# EasyEDA Pro project AT32M412_EVB.eprj, board AT32M412_EVB
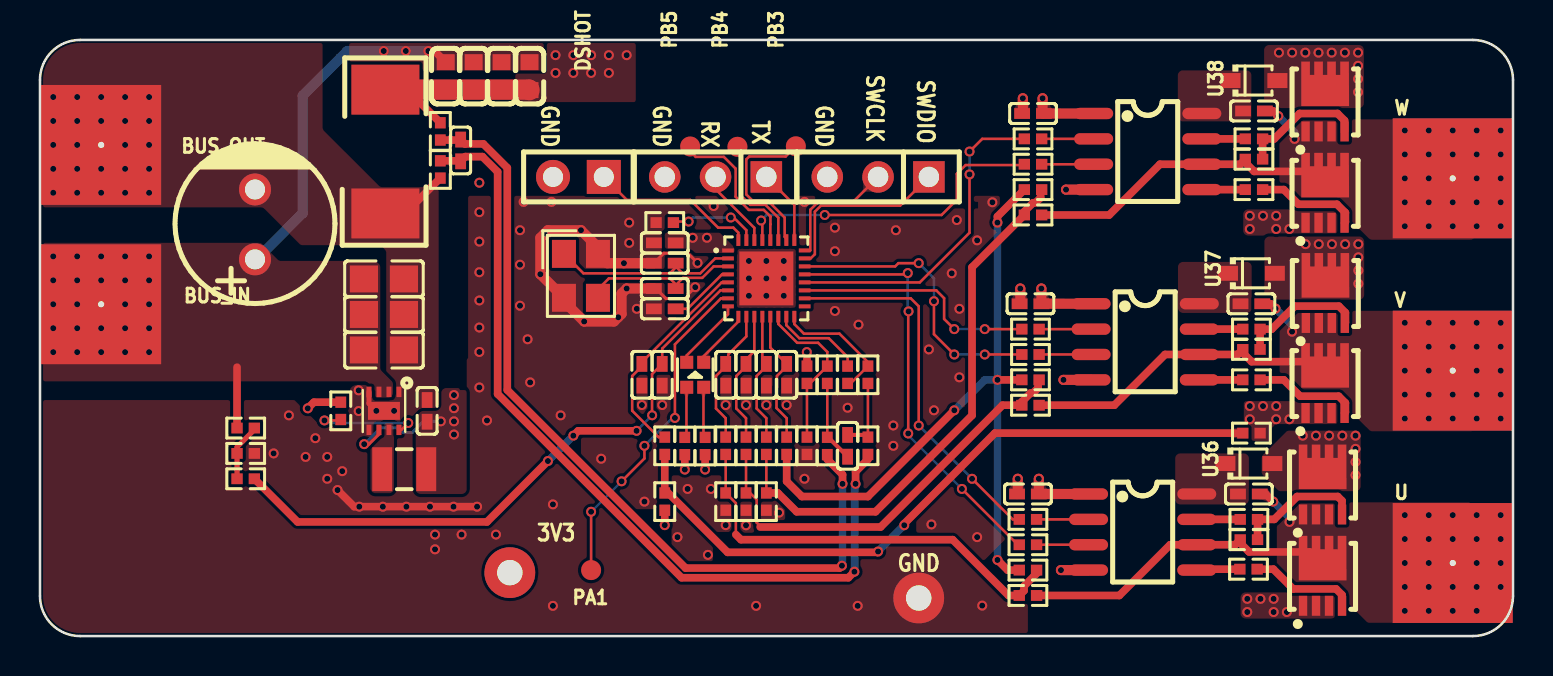
[diagram p4: board, top side]
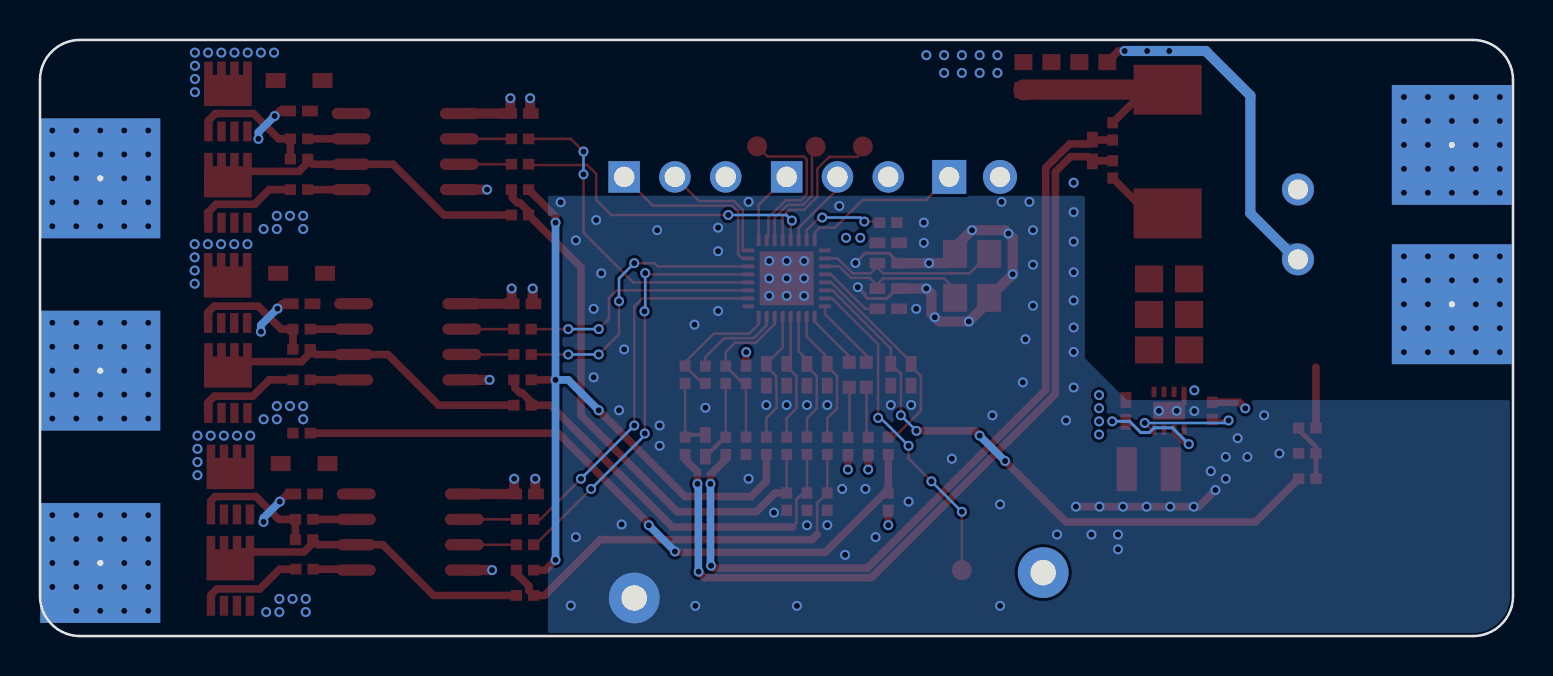
[diagram p5: board, bottom side, seen from below]

Outline 73.66 x 29.84 mm; copper layers: Top Layer, GND02, PWR03, Bottom Layer. Coordinates in mm from the lower left corner of the outline.
Outline path: 0,27.84 0,2 arc(0.59,0.59) 2,0 71.66,0 arc(73.07,0.59) 73.66,2 73.66,27.84 arc(73.07,29.26) 71.66,29.84 2,29.84 arc(0.59,29.26) 0,27.84
Stack: Top Layer 0.035mm 外层铜厚1oz / Dielectric1 0.2104mm 7628 RC49% 8.6mil / GND02 0.0152mm 内层铜厚 / Dielectric2 1.065mm 1.1mm H/HOZ Copper / PWR03 0.0152mm 内层铜厚 / Dielectric3 0.2104mm 7628 RC49% 8.6mil / Bottom Layer 0.035mm 外层铜厚1oz

## Design rules (mm)
template: 自定义配置
spacing copperThickness1oz (default): track to track 0.102, other pairs 0.152 to 0.3
spacing copperThickness2oz: track to track 0.203, other pairs 0.152 to 0.3
spacing edgeClearance: track to track 0.152, other pairs 0 to 0.152
track width copperThickness1oz (default): min 0.127, default 0.127, max 2.54
track width PWR: min 0.152, default 0.381, max 2.54
differential pair 90ohm (default): width min 0.152, default 0.152, max 0.152; gap min 0.178, default 0.178
via viaSize (default): diameter min 0.5, default 0.5, max 10; hole min 0.3, default 0.305, max 6.299
net GND uses PWR
net VCC_3V3 uses PWR
net GNDP uses PWR
net VBUS uses PWR
region e2146 uses edgeClearance
region e2147 uses edgeClearance
region e2148 uses edgeClearance
region e923 uses edgeClearance
region e924 uses edgeClearance

## Placement (name value [footprint] x y rotation side)
ATLINK  PM254V-11-03-H85  [HDR-TH_3P-P2.54-V-F]  41.91 22.99 180 top
BUS_IN  -  [PAD_35A]  1.79 17.12 0 top
BUS_OUT  -  [PAD_35A]  1.79 25.1 0 top
C131  100nF  [C0402]  31.24 19.69 0 top
C205  220uF  [CAP-TH_BD8.0-P3.50-D0.6-FD]  10.75 20.61 90 top
C206  22uF  [C0805]  17.2 16.1 180 top
C207  22uF  [C0805]  17.2 17.88 180 top
C208  10uF  [C0805]  17.2 14.32 180 top
C210  22uF  [C0402]  19.36 11.27 270 top
C211  100nF  [C0402]  31.24 16.38 0 top
C212  12pF  [C0402]  31.24 18.67 180 top
C213  12pF  [C0402]  31.24 17.4 0 top
C214  100nF  [C0402]  49.4 7.11 180 top
C215  100nF  [C0402]  60.45 7.11 180 top
C216  100nF  [C0402]  49.53 16.64 180 top
C217  100nF  [C0402]  60.58 16.64 180 top
C218  100nF  [C0402]  49.66 26.16 180 top
C219  100nF  [C0402]  60.71 26.29 180 top
C220  2.2nF  [C0402]  21.03 24.31 270 top
C221  2.2uF  [C0603]  24.48 28.03 90 top
C222  2.2uF  [C0603]  21.69 28.03 90 top
C223  2.2uF  [C0603]  20.29 28.03 90 top
C224  2.2uF  [C0603]  23.08 28.03 90 top
C225  100nF  [C0402]  31.12 13.08 90 top
C226  100nF  [C0402]  30.1 13.08 90 top
C227  33pF  [C0402]  34.29 13.08 90 top
C228  33pF  [C0402]  35.31 13.08 90 top
C229  33pF  [C0402]  36.32 13.08 90 top
C230  33pF  [C0402]  37.34 13.08 90 top
C231  100pF  [C0402]  40.39 9.53 270 top
D37  1N4148WS  [SOD-323_L1.8-W1.3-LS2.5-RD]  60.45 8.64 0 top
D38  1N4148WS  [SOD-323_L1.8-W1.3-LS2.5-RD]  60.58 18.16 0 top
D39  1N4148WS  [SOD-323_L1.8-W1.3-LS2.5-RD]  60.71 27.81 0 top
DSHOT  2.54-1*2P母  [HDR-TH_2P-P2.54-V-F]  26.92 22.99 180 top
L11  2.2uH  [IND-SMD_L2.5-W2.0_MHCHL2520]  18.22 8.35 0 top
LED1  NCD1615RG1  [LED-SMD_4P-L1.6-W1.5-TL-1]  32.77 13.08 270 top
NOREF  -  [Pad_e740]  23.5 3.17 0 top
NOREF#2  -  [Pad_e738]  43.94 1.91 0 top
PA1  -  [Mark-Point-1mm]  27.56 3.3 0 top
PB3  -  [Mark-Point-1mm]  37.8 24.52 0 top
PB4  -  [Mark-Point-1mm]  34.88 24.5 0 top
PB5  -  [Mark-Point-1mm]  32.51 24.51 0 top
Q1  TMG60N04DF  [POWERDI3333-8_DMN7022LFGQ-7]  64.13 7.11 0 top
Q2  TMG60N04DF  [POWERDI3333-8_DMN7022LFGQ-7]  64.13 2.54 0 top
Q3  TMG60N04DF  [POWERDI3333-8_DMN7022LFGQ-7]  64.28 16.7 0 top
Q4  TMG60N04DF  [POWERDI3333-8_DMN7022LFGQ-7]  64.26 12.19 0 top
Q5  TMG60N04DF  [POWERDI3333-8_DMN7022LFGQ-7]  64.26 26.29 0 top
Q6  TMG60N04DF  [POWERDI3333-8_DMN7022LFGQ-7]  64.26 21.72 0 top
R186  100kΩ  [R0402]  15.04 11.27 270 top
R188  1kΩ  [R0402]  31.24 20.7 180 top
R189  1kΩ  [R0402]  32.24 9.51 90 top
R190  1kΩ  [R0402]  33.26 9.51 90 top
R191  10Ω  [R0402]  60.45 5.84 0 top
R192  10Ω  [R0402]  60.43 3.35 0 top
R193  10Ω  [R0402]  60.58 15.37 0 top
R194  10Ω  [R0402]  60.58 12.83 0 top
R195  10Ω  [R0402]  60.71 24.89 0 top
R196  10Ω  [R0402]  60.71 22.35 0 top
R197  10Ω  [R0402]  49.4 5.84 0 top
R198  10Ω  [R0402]  49.4 4.57 0 top
R199  10Ω  [R0402]  49.53 15.37 0 top
R200  10Ω  [R0402]  49.53 14.1 0 top
R201  10Ω  [R0402]  49.66 24.89 0 top
R202  10Ω  [R0402]  49.66 23.62 0 top
R203  2mΩ  [RES-SMD_L6.4-W3.2-1]  17.27 24.26 270 top
R204  10Ω  [R0402]  20.02 25.27 90 top
R205  10Ω  [R0402]  20.02 23.36 270 top
R206  NCP15XH103F03RC  [R0402]  60.58 10.16 180 top
R207  3kΩ  [R0402]  31.24 6.73 270 top
R208  100Ω  [R0402]  10.29 7.87 0 top
R209  100Ω  [R0402]  31.24 9.53 90 top
R211  51kΩ  [R0402]  49.4 3.3 0 top
R213  3kΩ  [R0402]  34.29 6.73 270 top
R214  43kΩ  [R0402]  49.4 2.03 0 top
R215  51kΩ  [R0402]  49.53 12.83 0 top
R216  43kΩ  [R0402]  49.53 11.56 0 top
R217  3kΩ  [R0402]  35.31 6.73 270 top
R218  51kΩ  [R0402]  49.66 22.35 0 top
R219  43kΩ  [R0402]  49.66 21.08 0 top
R220  3kΩ  [R0402]  36.32 6.73 270 top
R221  1Ω  [R0402]  34.29 9.53 90 top
R222  1Ω  [R0402]  35.31 9.53 90 top
R223  1Ω  [R0402]  36.32 9.53 90 top
R224  1Ω  [R0402]  37.34 9.53 90 top
R225  1.2kΩ  [R0402]  39.37 9.52 90 top
R226  1.2kΩ  [R0402]  41.4 9.53 90 top
R227  1.2kΩ  [R0402]  39.37 13.08 90 top
R228  1.2kΩ  [R0402]  41.4 13.08 90 top
R229  66.5kΩ  [R0402]  40.39 13.08 90 top
R230  47kΩ  [R0402]  10.29 10.41 0 top
R231  10kΩ  [R0402]  10.29 9.14 0 top
R237  133kΩ  [R0402]  38.35 13.08 270 top
R238  133kΩ  [R0402]  38.35 9.53 90 top
R239  10kΩ  [R0402]  60.45 4.83 0 top
R240  10kΩ  [R0402]  60.58 14.35 0 top
R241  10kΩ  [R0402]  60.71 23.88 0 top
U  -  [PAD_35A]  69.38 4.17 0 top
U33  TPS62172DSGR  [WSON-8_L2.0-W2.0-P0.50-TL-EP]  17.2 11.27 270 top
U34  AT32M412KBU7-4  [WQFN-32_L4.0-W4.0-P0.40-TL-EP2.7]  36.32 17.91 0 top
U36  IRS21867STRPBF  [SOIC-8_L5.0-W4.0-P1.27-LS6.0-BL]  55.14 5.21 270 top
U37  IRS21867STRPBF  [SOIC-8_L5.0-W4.0-P1.27-LS6.0-BL]  55.27 14.73 270 top
U38  IRS21867STRPBF  [SOIC-8_L5.0-W4.0-P1.27-LS6.0-BL]  55.39 24.26 270 top
UART  PM254V-11-03-H85  [HDR-TH_3P-P2.54-V-F]  33.78 22.99 180 top
V  -  [PAD_35A]  69.38 13.8 0 top
W  -  [PAD_35A]  69.38 23.42 0 top
X3  24MHz  [CRYSTAL-SMD_4P-L3.2-W2.5-BL]  27.05 18.03 270 top

## Footprints (pads in the part's own frame, mm; a bottom-side part is the same pattern mirrored in y, then rotated)
C0402
  rect 0.79x0.54 smd: 1(-0.545,0) 2(0.545,0)
C0603
  rect 0.8x0.9 smd: 1(-0.7,0) 2(0.7,0)
C0805
  rect 1.41x1.35 smd: 1(-1,0) 2(1,0)
CAP-TH_BD8.0-P3.50-D0.6-FD
  round 1.6 hole 1: 1(-1.75,0) 2(1.75,0)
CRYSTAL-SMD_4P-L3.2-W2.5-BL
  rect 1.4x1.2 smd: 1(-1.1,-0.85) 2(1.1,-0.85) 3(1.1,0.85) 4(-1.1,0.85)
HDR-TH_2P-P2.54-V-F
  rect 1.7x1.7 hole 1: 1(-1.27,0)
  round 1.7 hole 1: 2(1.27,0)
HDR-TH_3P-P2.54-V-F
  rect 1.575x1.575 hole 1.02: 1(-2.54,0)
  round 1.575 hole 1.02: 2(0,0) 3(2.54,0)
IND-SMD_L2.5-W2.0_MHCHL2520
  rect 1x2.2 smd: 1(-1.1,0) 2(1.1,0)
LED-SMD_4P-L1.6-W1.5-TL-1
  rect 0.65x0.65 smd: 1(-0.625,0.425) 2(0.625,0.425) 3(-0.625,-0.425) 4(0.625,-0.425)
Mark-Point-1mm
  round 1 smd: 1(0,0)
PAD_35A
  rect 6x6 hole 0.305: 1(1.27,-0.508)
Pad_e738
  round 2.54 hole 1.27: 1(0,0)
Pad_e740
  round 2.54 hole 1.27: 1(0,0)
POWERDI3333-8_DMN7022LFGQ-7
  rect 0.42x1 smd: 1(-0.975,-1.025) 2(-0.325,-1.025) 3(0.325,-1.025) 4(0.975,-1.025)
  custom 2.39x2.23 smd: 5(0.005,1.025)
R0402
  rect 0.566x0.54 smd: 1(-0.433,0) 2(0.433,0)
RES-SMD_L6.4-W3.2-1
  rect 2.5x3.4 smd: 1(-3.1,0) 2(3.1,0)
SOD-323_L1.8-W1.3-LS2.5-RD
  rect 1x0.75 smd: 1(-1.173,0) 2(1.173,0)
SOIC-8_L5.0-W4.0-P1.27-LS6.0-BL
  oval 0.569x1.95 smd: 1(-1.905,-2.705) 2(-0.635,-2.705) 3(0.635,-2.705) 4(1.905,-2.705) 5(1.905,2.705) 6(0.635,2.705) 7(-0.635,2.705) 8(-1.905,2.705)
WQFN-32_L4.0-W4.0-P0.40-TL-EP2.7
  rect 0.585x0.2 smd: 1(-1.917,1.4) 2(-1.917,1) 3(-1.917,0.6) 4(-1.917,0.2) 5(-1.917,-0.2) 6(-1.917,-0.6) 7(-1.917,-1) 8(-1.917,-1.4) 17(1.917,-1.4) 18(1.917,-1) 19(1.917,-0.6) 20(1.917,-0.2) 21(1.917,0.2) 22(1.917,0.6) 23(1.917,1) 24(1.917,1.4)
  rect 0.2x0.585 smd: 9(-1.4,-1.917) 10(-1,-1.917) 11(-0.6,-1.917) 12(-0.2,-1.917) 13(0.2,-1.917) 14(0.6,-1.917) 15(1,-1.917) 16(1.4,-1.917) 25(1.4,1.917) 26(1,1.917) 27(0.6,1.917) 28(0.2,1.917) 29(-0.2,1.917) 30(-0.6,1.917) 31(-1,1.917) 32(-1.4,1.917)
  rect 2.7x2.7 smd: 33(0,0)
WSON-8_L2.0-W2.0-P0.50-TL-EP
  rect 0.521x0.25 smd: 1(-0.95,0.75) 2(-0.95,0.25) 3(-0.95,-0.25) 4(-0.95,-0.75) 5(0.95,-0.75) 6(0.95,-0.25) 7(0.95,0.25) 8(0.95,0.75)
  rect 0.9x1.6 smd: 9(0,0)

## Nets
As in the schematic, except:
GND: ATLINK.3 BUS_OUT.1 C131.1 C205.2 C206.1 C207.1 C208.1 C210.1 C211.1 C212.2 C213.1 C225.1 C226.1 C227.1 C228.1 C229.1 C230.1 DSHOT.2 NOREF#2.1 R188.2 R203.2 R205.2 R213.2 R217.2 R220.2 R231.2 R238.1 U33.1 U33.4 U33.5 U33.9 U34.33 UART.3 X3.2 X3.4
VCC_3V3: C131.2 C210.2 L11.2 NOREF.1 R186.1 R189.1 R190.1 R207.2 R237.1 U33.6 U34.1

Pads without a net: U34 17

## Via types
v1: diameter 0.5, hole 0.305, Top Layer to Bottom Layer, 342 vias

## Routing (per net, layer and track width the routed paths; a pad name or vN(x,y) marks a point on that pad's centre or on a via; arc(x,y) is an arc through that point)
GND: length 34.5
  Top Layer w0.152: C212.2 31.2,19.17 32.39,19.17 v1(32.88,18.68) ; v1(32.77,17.47) 32.41,17.11 32.41,17.03 32.28,16.9 31.3,16.9 30.8,17.4
  Top Layer w0.254: v1(17.71,11.27) v1(16.82,11.27) 16.45,11.64 U33.4
  Top Layer w0.381: R205.2 18.25,21.16 17.27,21.16 ; v1(14.88,7.31) 15.71,6.48 v1(15.97,6.48) v1(17.14,6.48) v1(18.32,6.48) v1(19.5,6.48) v1(20.68,6.48) v1(21.86,6.48)
  Top Layer w0.508: C213.1 v1(29.34,17.4) 29.08,17.14 29.08,16.13 28.7,15.75 v1(27.21,15.75) 26.11,16.85 X3.2 v1(25.02,18.11) 25.02,19.94 25.4,20.32 v1(27.05,20.32) 27.9,19.47 X3.4 28.37,18.67 v1(29.2,18.67) C212.2
  vias: v1(0.66,26.99) v1(0.66,25.79) v1(0.66,24.59) v1(0.66,23.39) v1(0.66,22.19) v1(1.86,26.99) v1(1.86,25.79) v1(1.86,24.59) v1(1.86,23.39) v1(1.86,22.19) v1(3.06,26.99) v1(3.06,25.79) v1(3.06,23.39) v1(3.06,22.19) v1(4.26,26.99) v1(4.26,25.79) v1(4.26,24.59) v1(4.26,23.39) v1(4.26,22.19) v1(5.46,26.99) v1(5.46,25.79) v1(5.46,24.59) v1(5.46,23.39) v1(5.46,22.19) v1(11.68,9.14) v1(12.45,11.05) v1(13.28,8.97) v1(13.77,9.91) v1(14.36,8.97) v1(14.36,7.87) v1(15.11,8.25) v1(15.94,12.3) v1(15.94,11.27) v1(19.75,5.08) v1(19.75,4.34) v1(21.08,5.08) v1(21.97,22.7) v1(21.97,21.22) v1(21.97,19.75) v1(21.97,18.22) v1(21.97,16.8) v1(21.97,15.45) v1(21.97,14.22) v1(21.97,12.45) v1(22.35,10.8) v1(22.8,5.08) v1(24,20.32) v1(24,18.59) v1(24,16.54) v1(24.18,21.74) v1(24.38,14.86) v1(24.51,12.7) v1(25.23,20.15) v1(25.58,21.74) v1(25.65,6.59) v1(25.65,1.51) v1(26.03,11.05) v1(28.06,8.88) v1(28.91,15.96) v1(29.46,20.7) v1(29.46,19.69) v1(29.84,16.38) v1(30.1,11.57) v1(30.23,6.73) v1(31.12,11.57) v1(31.88,4.95) v1(32.38,7.37) v1(33.4,4.06) v1(33.55,7.37) v1(33.69,21.53) v1(34.29,11.57) v1(34.29,5.55) v1(35.31,11.57) v1(35.31,5.55) v1(35.45,18.78) v1(35.45,17.91) v1(35.45,17.03) v1(35.81,1.51) v1(36.32,18.78) v1(36.32,17.91) v1(36.32,17.03) v1(36.32,11.57) v1(36.96,6.18) v1(37.19,18.78) v1(37.19,17.91) v1(37.19,17.03) v1(37.34,11.57) v1(38.23,21.74) v1(38.23,7.87) v1(39.75,20.45) v1(39.75,19.27) v1(39.75,16.28) v1(40.39,11.43) v1(40.93,15.59) v1(40.89,1.51) v1(42.67,10.54) v1(42.67,9.53) v1(42.8,20.32) v1(44.45,14.35) v1(44.58,5.59) v1(44.7,11.3) v1(45.59,18.16) v1(45.85,20.83) v1(45.97,16.38) v1(45.97,12.95) v1(46.86,19.81) v1(46.86,4.95) v1(47.12,1.52) v1(47.62,21.72)
GNDP: length 15.9
  Top Layer w0.381: 18.36,27.36 R204.2
  Top Layer w0.508: U37.4 v1(51.18,12.83) ; U36.4 v1(51.05,3.3) ; U38.4 v1(51.31,22.35) ; C214.2 48.9,7.15 v1(48.9,7.87) ; 49.02,16.67 v1(49.02,17.4) ; 49.15,26.2 v1(49.15,26.92)
  Top Layer w1.016: C221.1 24.46,27.36 R203.1
  vias: v1(25.78,29.08) v1(25.78,28.19) v1(26.67,29.08) v1(26.67,28.19) v1(27.56,29.08) v1(27.56,28.19) v1(28.45,29.08) v1(28.45,28.19) v1(29.34,29.08) v1(60.37,1.86) v1(60.37,1.2) v1(60.5,21.04) v1(60.5,20.38) v1(60.5,11.51) v1(60.5,10.85) v1(61.03,1.86) v1(61.16,21.04) v1(61.16,11.51) v1(61.69,1.86) v1(61.69,1.2) v1(61.82,21.04) v1(61.82,20.38) v1(61.82,11.51) v1(61.82,10.85) v1(62.35,1.2) v1(62.48,20.38) v1(62.48,10.85)
VBUS: length 30.1
  Top Layer w0.381: R230.1 9.85,13.46 ; C223.2 19.73,29.29 v1(19.42,29.29)
  Top Layer w0.508: U36.1 C214.1 v1(49.95,7.87) ; C218.1 U38.1 ; 50.14,26.16 v1(50.14,26.92) ; v1(50.07,17.4) C216.1 U37.1
  Bottom Layer w0.508: v1(19.42,29.29) v1(18.29,29.29) v1(17.19,29.29) 15.37,29.29 13.13,27.06 13.13,21.17 10.92,18.96
  vias: v1(0.66,19.01) v1(0.66,17.81) v1(0.66,16.61) v1(0.66,15.41) v1(0.66,14.22) v1(1.86,19.01) v1(1.86,17.81) v1(1.86,16.61) v1(1.86,15.41) v1(1.86,14.22) v1(3.06,19.01) v1(3.06,17.81) v1(3.06,15.41) v1(3.06,14.22) v1(4.26,19.01) v1(4.26,17.81) v1(4.26,16.61) v1(4.26,15.41) v1(4.26,14.22) v1(5.46,19.01) v1(5.46,17.81) v1(5.46,16.61) v1(5.46,15.41) v1(5.46,14.22) v1(61.96,29.21) v1(62.61,29.21) v1(63.15,10.03) v1(63.27,29.21) v1(63.29,19.62) v1(63.81,10.03) v1(63.93,29.21) v1(63.95,19.62) v1(64.47,10.03) v1(64.59,29.21) v1(64.61,19.62) v1(65.13,10.03) v1(65.25,29.21) v1(65.27,19.62) v1(65.78,10.03) v1(65.78,9.37) v1(65.78,8.71) v1(65.78,8.05) v1(65.91,29.21) v1(65.91,28.55) v1(65.91,27.89) v1(65.91,27.23) v1(65.93,19.62) v1(65.93,18.96) v1(65.93,18.3) v1(65.93,17.64)
VBUS_REF: length 2.9
  Top Layer w0.254: R230.2 10.72,10.33 9.85,9.47 R231.1 R208.1
VCC_3V3: length 10.4
  Top Layer w0.152: U33.6 16.95,10.11 16.45,9.61 v1(16.21,9.61)
  Top Layer w0.381: R186.1 13.7,11.71 v1(13.39,11.4) ; v1(38.35,14.22) 38.35,14.21 R237.1 ; R189.1 v1(32.24,8.34) ; R207.2 v1(31.24,5.55) ; R190.1 v1(33.26,8.34)
  Bottom Layer w0.152: v1(16.21,9.61) 17.03,10.43 17.94,10.43 18.18,10.19 18.61,10.19 19.17,10.75 v1(20.04,10.75)
  vias: v1(20.7,12.06) v1(20.7,11.41) v1(20.7,10.75) v1(20.7,10.09) v1(32.64,19.94) v1(33.35,19.94)
BOOT0: length 4.5
  Top Layer w0.127: 31.68,20.7 31.73,20.75 v1(32.44,20.75) ; v1(34.54,20.95) 34.69,20.95 35.32,20.32 U34.31
  Bottom Layer w0.127: v1(34.54,20.95) 32.64,20.95 v1(32.44,20.75)
COM_NUTRAL: length 36.2
  Top Layer w0.381: v1(47.88,3.81) 48.39,3.3 R211.1 ; v1(47.88,20.7) 47.88,21.01 R218.1 ; v1(47.88,12.83) R215.1 ; R224.1 37.34,7.75 38.1,6.98 41.4,6.98 v1(45.72,11.3)
  Bottom Layer w0.381: v1(47.88,3.81) v1(47.88,12.83) ; v1(47.88,12.83) 47.24,12.83 v1(45.72,11.3) ; v1(47.88,12.83) v1(47.88,20.7)
EMF1: length 21.3
  Top Layer w0.127: R221.1 R213.1 34.8,6.66 34.8,5.08
  Top Layer w0.381: R211.2 49.91,3.23 49.91,3.2 49.21,2.5 49.21,2.27 R214.1 48.43,2.03 45.64,4.83 35.05,4.83 34.8,5.08
EMF2: length 21.4
  Top Layer w0.127: 36.02,5.46 36.04,5.48 35.84,5.68 35.84,6.83 35.51,7.16 R217.1 R222.1
  Top Layer w0.381: 36.02,5.46 42.04,5.46 48.13,11.56 R216.1 49.1,11.73 49.54,12.17 49.66,12.17 49.91,12.42 49.91,12.78 R215.2
EMF3: length 27.4
  Top Layer w0.127: R220.1 R223.1
  Top Layer w0.381: R218.2 50.04,22.3 50.04,21.95 49.79,21.69 49.66,21.69 49.22,21.25 R219.1 46.61,18.47 46.61,11.05 41.78,6.22 37.84,6.22 36.9,7.16 R220.1
EMF_NUTRAL: length 6.8
  Top Layer w0.127: R224.2 37.34,10.91 36.83,11.42 36.83,12.45 36.85,12.47 36.85,13.02 37.34,13.51 C230.2 36.52,14.44 U34.13
EMF_U: length 6.9
  Top Layer w0.127: U34.10 35.32,15 34.42,14.1 34.42,13.75 C227.2 34.29,13.51 33.8,13.02 33.8,11.39 34.29,10.91 R221.2
EMF_V: length 6.6
  Top Layer w0.127: U34.11 35.72,14.26 35.31,13.84 C228.2 35.31,13.51 34.82,13.02 34.82,11.39 35.31,10.91 R222.2
EMF_W: length 6.5
  Top Layer w0.127: R223.2 36.32,10.91 35.84,11.39 35.84,13.02 36.32,13.51 C229.2 36.12,13.83 U34.12
I_BUS_GND: length 42.2
  Top Layer w0.381: R205.1 21.01,23.79 C220.2 21.27,24 22.12,24 22.89,23.24 22.89,12.12 32.08,2.92 40.42,2.92 v1(40.72,3.22) ; v1(40.78,7.62) 40.78,8.23 41.4,8.85 R226.1
  Bottom Layer w0.381: v1(40.78,7.62) 40.78,7.49 40.74,7.45 40.74,3.4
I_BUS_SHUNT: length 41.4
  Top Layer w0.381: v1(40.13,7.62) 40.13,8.08 39.37,8.85 39.37,9.09 ; v1(40.1,3.52) 39.98,3.4 32.28,3.4 23.37,12.32 23.37,23.44 22.17,24.64 21.25,24.64 C220.1 21.01,24.83 20.02,24.83
  Bottom Layer w0.381: v1(40.13,7.62) 40.13,3.55 v1(40.1,3.52)
LED_G: length 3
  Top Layer w0.127: U34.9 34.92,15.75 33.19,14.01 LED1.1
LED_R: length 3.7
  Top Layer w0.127: 34.4,16.51 34.4,16.12 32.34,14.05 LED1.3
MOS_NTC: length 34.7
  Top Layer w0.381: v1(41.91,4.23) 41.87,4.19 34.39,4.19 31.33,7.25 R207.1 R209.1 ; R206.2 47.75,10.16 43.22,5.62 v1(43.22,5.55)
  Bottom Layer w0.381: v1(41.91,4.23) 41.91,4.24 v1(43.22,5.55)
MOS_TEMP: length 10.8
  Top Layer w0.127: R209.2 30.94,9.96 29.61,11.28 29.61,13.02 30.1,13.51 C226.2 30.1,13.72 34.09,17.71 U34.5
NRST: length 3.3
  Top Layer w0.127: 31.79,16.38 32.38,16.38 34.11,18.11 U34.4
OP3_INM_BUS: length 6.4
  Top Layer w0.127: U34.16 37.72,15.62 38.2,15.14 39.98,15.14 41.4,13.72 R228.2 40.54,12.65 R229.1
OP3_INP_BUS: length 8.2
  Top Layer w0.127: U34.14 36.92,15.62 37.86,14.68 38.91,14.68 39.37,14.22 R227.2 38.5,12.65 R237.2 R238.2
OP3_OUT_BUS: length 4.6
  Top Layer w0.127: U34.15 37.32,15.56 37.97,14.91 39.44,14.91 40.39,13.97 R229.2
OSC_IN: length 9.4
  Top Layer w0.127: 31.79,18.5 31.79,18.45 31.5,18.16 27.17,18.16 X3.1 ; 31.79,18.5 31.79,18.67 ; 31.79,18.5 32.13,18.16 33.02,18.16 33.77,18.91 U34.2
OSC_OUT: length 7.9
  Top Layer w0.127: 31.79,17.56 31.79,17.62 31.5,17.91 28.45,17.91 27.9,17.36 X3.3 ; 31.79,17.56 31.79,17.4 ; 31.79,17.56 32.16,17.93 33.11,17.93 33.69,18.51 34.4,18.51
OUT1: length 18.3
  Top Layer w0.381: 64.14,3.56 63.49,4.21 60.46,4.21 60.02,4.65 R239.1 59.76,4.57 U36.6 56.51,4.57 53.97,2.03 R214.2 ; C215.1 61.29,7.11 v1(61.67,6.73)
  Bottom Layer w0.381: v1(62.48,5.72) 62.48,5.92 v1(61.67,6.73)
  vias: v1(68.25,6.06) v1(68.25,4.86) v1(68.25,3.66) v1(68.25,2.46) v1(68.25,1.26) v1(69.45,6.06) v1(69.45,4.86) v1(69.45,3.66) v1(69.45,2.46) v1(69.45,1.26) v1(70.65,6.06) v1(70.65,4.86) v1(70.65,2.46) v1(70.65,1.26) v1(71.84,6.06) v1(71.84,4.86) v1(71.84,3.66) v1(71.84,2.46) v1(71.84,1.26) v1(73.04,6.06) v1(73.04,4.86) v1(73.04,3.66) v1(73.04,2.46)
OUT2: length 18.3
  Top Layer w0.381: C217.1 61.54,16.64 v1(61.78,16.4) ; Q4.5 63.75,13.74 60.59,13.74 60.15,14.18 R240.1 59.89,14.1 U37.6 56.26,14.1 53.72,11.56 R216.2
  Bottom Layer w0.381: v1(62.61,15.24) 62.61,15.57 v1(61.78,16.4)
  vias: v1(68.25,15.68) v1(68.25,14.49) v1(68.25,13.29) v1(68.25,12.09) v1(68.25,10.89) v1(69.45,15.68) v1(69.45,14.49) v1(69.45,13.29) v1(69.45,12.09) v1(69.45,10.89) v1(70.65,15.68) v1(70.65,14.49) v1(70.65,12.09) v1(70.65,10.89) v1(71.84,15.68) v1(71.84,14.49) v1(71.84,13.29) v1(71.84,12.09) v1(71.84,10.89) v1(73.04,15.68) v1(73.04,14.49) v1(73.04,13.29) v1(73.04,12.09) v1(73.04,10.89)
OUT3: length 18.2
  Top Layer w0.381: v1(61.92,26.03) 61.67,26.29 61.25,26.29 ; Q6.5 63.75,23.26 60.71,23.26 60.27,23.7 R241.1 60.02,23.62 U38.6 56.01,23.62 53.47,21.08 R219.2
  Bottom Layer w0.381: v1(61.92,26.03) 62.74,25.22 v1(62.74,24.89)
  vias: v1(68.25,25.31) v1(68.25,24.11) v1(68.25,22.92) v1(68.25,21.72) v1(68.25,20.52) v1(69.45,25.31) v1(69.45,24.11) v1(69.45,22.92) v1(69.45,21.72) v1(69.45,20.52) v1(70.65,25.31) v1(70.65,24.11) v1(70.65,21.72) v1(70.65,20.52) v1(71.84,25.31) v1(71.84,24.11) v1(71.84,22.92) v1(71.84,21.72) v1(71.84,20.52) v1(73.04,25.31) v1(73.04,24.11) v1(73.04,22.92) v1(73.04,21.72) v1(73.04,20.52)
PWM_IN_DSHOT: length 8.3
  Top Layer w0.127: U34.32 34.92,20.2 34.67,20.45 33.91,20.45 32.52,21.83 29.35,21.83 DSHOT.1
SWCLK: length 6.4
  Top Layer w0.127: U34.24 38.52,19.31 38.52,21.34 38.96,21.78 40.7,21.78 ATLINK.2
SWDIO: length 9.1
  Top Layer w0.127: ATLINK.1 43.01,21.55 39.05,21.55 38.75,21.25 38.75,19.12 38.54,18.91 U34.23
TIM1_CH1: length 18.8
  Top Layer w0.127: R197.1 48.64,5.84 v1(46.61,7.87) ; U34.18 43.54,16.91 43.94,16.51 v1(43.94,10.54)
  Bottom Layer w0.127: v1(46.61,7.87) v1(43.94,10.54)
TIM1_CH1N: length 21.2
  Top Layer w0.127: v1(46.1,7.37) 48.9,4.57 R198.1 ; v1(43.43,16.26) 43.42,16.24 v1(43.42,10.14) ; v1(43.4,18.17) 43.33,18.11 U34.21
  Bottom Layer w0.127: v1(43.42,10.14) 43.42,10.05 v1(46.1,7.37) ; v1(43.4,18.17) 43.4,16.3 v1(43.43,16.26)
TIM1_CH2: length 12.3
  Top Layer w0.127: U34.19 44.82,17.31 45.21,16.92 45.21,15.88 v1(45.72,15.37) ; v1(47.24,15.37) R199.1
  Bottom Layer w0.127: v1(47.24,15.37) v1(45.72,15.37)
TIM1_CH2N: length 14.5
  Top Layer w0.127: v1(43.94,18.67) 42.93,18.67 42.76,18.51 38.24,18.51 ; v1(45.72,14.1) 44.7,15.11 v1(44.7,16.76) ; v1(47.24,14.1) R200.1
  Bottom Layer w0.127: v1(44.7,16.76) 44.7,17.91 v1(43.94,18.67) ; v1(47.24,14.1) v1(45.72,14.1)
TIM1_CH3: length 16.3
  Top Layer w0.127: U34.20 44,17.71 46.48,20.19 v1(46.48,23.11) ; v1(46.48,24.26) 47.12,24.89 R201.1
  Bottom Layer w0.127: v1(46.48,23.11) v1(46.48,24.26)
TIM1_CH3N: length 16.1
  Top Layer w0.127: v1(36.06,20.8) 36.06,20.76 36.12,20.7 U34.29 ; v1(39.24,21.08) 45.09,21.08 45.85,21.84 45.85,23.14 46.29,23.58 49.18,23.58 R202.1
  Bottom Layer w0.127: v1(36.06,20.8) 36.34,21.08 v1(39.24,21.08)
UART_RX: length 4
  Top Layer w0.127: U34.30 35.72,20.44 33.78,22.38 UART.2
UART_TX: length 3.7
  Top Layer w0.127: U34.25 37.72,21.59 UART.1
V_BUS_FB: length 31
  Top Layer w0.127: 30.61,11.05 30.61,13.12 C225.2 31.12,14.39 34.03,17.31 U34.6
  Top Layer w0.381: R208.2 12.88,5.72 22.35,5.72 v1(25.4,8.76) ; v1(26.67,10.03) 26.91,10.28 v1(29.83,10.28)
  Bottom Layer w0.127: v1(30.61,11.05) 29.84,10.29
  Bottom Layer w0.381: v1(26.67,10.03) v1(25.4,8.76)
$1N4081: length 5.7
  Top Layer w0.127: v1(18.41,10.67) 18.07,10.32 U33.8 ; R186.2 14.99,10.8 v1(14.22,10.8)
  Bottom Layer w0.127: v1(14.22,10.8) 14.35,10.67 v1(18.41,10.67)
$2N17330: length 16.7
  Top Layer w0.127: v1(29.08,7.75) 30.23,8.89 v1(30.23,9.53) ; v1(27.56,6.22) PA1.1 ; v1(31.75,10.92) 31.75,14.61 34.05,16.91 U34.7
  Bottom Layer w0.127: v1(29.08,7.75) v1(27.56,6.22) ; v1(31.75,10.92) 31.62,10.92 v1(30.23,9.53)
$2N18473: length 2.5
  Top Layer w0.127: LED1.4 32.33,12.44 32.33,10.03 32.24,9.95
$2N18489: length 2.5
  Top Layer w0.127: LED1.2 33.18,12.44 33.18,10.03 33.26,9.95
$2N29618: length 7.2
  Top Layer w0.127: U34.28 36.52,20.61 36.53,20.61 36.53,21 36.52,21 36.52,21.01 36.19,21.34 35.45,21.34 34.79,22 34.79,23.4 34.2,23.99 32.79,23.99 32.65,24.13 32.64,24.13
$2N29622: length 6
  Top Layer w0.127: PB4.1 35.05,24.32 35.05,22.05 35.52,21.59 36.28,21.59 36.92,20.94 U34.27
$2N29627: length 8.1
  Top Layer w0.127: U34.26 37.32,19.9 37.24,19.99 37.24,20.95 36.37,21.82 35.61,21.82 35.32,22.11 35.32,23.86 35.47,24.01 37.29,24.01 PB3.1
$9N980: length 2.2
  Top Layer w0.381: 57.8,5.84 R191.1
$9N1058: length 2.2
  Top Layer w0.381: 57.8,3.3 57.85,3.35 R192.1
$9N1116: length 5.3
  Top Layer w0.381: R192.2 61.68,3.35 62.67,2.36 64.81,2.36 65.11,2.06 Q2.4
$9N2021: length 2.2
  Top Layer w0.381: 57.93,15.37 R193.1
$9N2023: length 2.2
  Top Layer w0.381: 57.93,12.83 R194.1
$9N2025: length 5.3
  Top Layer w0.381: R194.2 62.2,12.83 63.01,12.01 64.94,12.01 65.28,11.67 65.28,11.21 65.24,11.17
$9N2497: length 2.2
  Top Layer w0.381: 58.05,24.89 R195.1
$9N2499: length 2.2
  Top Layer w0.381: 58.05,22.35 R196.1
$9N2501: length 5.1
  Top Layer w0.381: 61.14,22.35 62.2,22.35 62.93,21.62 64.85,21.62 65.28,21.2 65.28,20.73 Q6.4
$9N2585: length 2.6
  Top Layer w0.127: R197.2 U36.2
$9N2628: length 2.6
  Top Layer w0.127: R198.2 U36.3
$9N2671: length 2.6
  Top Layer w0.127: R199.2 U37.2
$9N2714: length 2.6
  Top Layer w0.127: R200.2 U37.3
$9N2757: length 2.6
  Top Layer w0.127: R201.2 U38.2
$9N2800: length 2.6
  Top Layer w0.127: R202.2 U38.3
$9N15811: length 6.5
  Top Layer w0.381: 65.11,6.09 65.11,6.77 64.9,6.98 62.86,6.98 61.72,5.84 R191.2 R239.2
$9N15835: length 6.4
  Top Layer w0.381: Q3.4 65.28,15.7 65.28,16.19 64.95,16.52 62.75,16.52 61.59,15.37 R193.2 R240.2
$9N15858: length 6.3
  Top Layer w0.381: Q5.4 65.24,25.81 64.88,26.16 62.99,26.16 61.72,24.89 61.14,24.89 61.14,23.88
$10N1086: length 3.8
  Top Layer w0.127: R226.2 R228.1
  Top Layer w0.203: C231.1 41.29,10.07 R226.2
$10N1091: length 4.1
  Top Layer w0.127: R225.2 R227.1
  Top Layer w0.203: C231.2 39.42,9.95 R225.2

## Copper pours and planes (outline as drawn; the poured copper is in the pictures)
GND on Top Layer: 15.13,11.56 15.23,11.58 15.31,11.63 15.42,11.74 15.47,11.82 15.49,11.92 15.49,12.32 15.64,12.51 15.88,12.57 16.35,12.57 16.52,12.5 16.6,12.32 16.6,12 16.67,11.82 16.85,11.75 17.49,11.75 17.58,11.77 17.67,11.82 17.71,11.86 17.76,11.95 17.78,12.04 17.78,12.55 17.76,12.65 17.71,12.73 17.39,13.05 17.33,13.13 17.31,13.23 17.31,19.18 17.29,19.28 17.24,19.36 17.1,19.5 17.02,19.55 16.92,19.57 13.15,19.57 13.05,19.59 12.97,19.64 11.22,21.39 11.14,21.44 11.04,21.46 0.25,21.46 0.07,21.54 0,21.72 0,29.59 0.07,29.77 0.25,29.85 13.88,29.85 14.06,29.77 14.13,29.59 14.13,25.47 14.15,25.37 14.21,25.29 16.94,22.55 17.03,22.5 17.12,22.48 19.69,22.48 19.86,22.4 19.94,22.23 19.94,11.63 19.86,11.45 19.69,11.37 19.1,11.37 19,11.35 18.92,11.3 18.49,10.87 18.41,10.81 18.31,10.8 16.89,10.8 16.71,10.72 16.64,10.54 16.64,10.4 16.62,10.3 16.56,10.22 16.32,9.98 16.24,9.93 16.14,9.91 16.11,9.91 16.01,9.89 15.93,9.83 15.44,9.35 15.39,9.26 15.37,9.17 15.37,7.32 15.29,7.14 15.11,7.07 14.71,7.07 14.61,7.09 14.53,7.14 11.89,9.79 11.83,9.87 11.81,9.97 11.81,11.3 11.89,11.48 12.07,11.56
GND on Top Layer: 0,11.82 19.31,11.82 21.41,13.92 21.41,22.04 49.4,22.04 49.4,0 0,0
GND on Bottom Layer: 0,11.82 19.31,11.82 21.41,13.92 21.41,22.04 48.26,22.04 48.26,0 0,0
GND on GND02: 0.16,24.81 48.2,24.81 48.2,0.16 0.16,0.16
GND on GND02: 0.16,29.69 21.22,29.69 21.22,12.01 0.16,12.01
GNDP on Top Layer: 60.17,21.11 60.19,21.21 60.24,21.29 60.32,21.34 60.42,21.36 64.69,21.36 64.78,21.34 64.86,21.29 64.92,21.21 64.94,21.11 64.94,20.31 64.92,20.21 64.86,20.13 64.78,20.08 64.69,20.06 60.42,20.06 60.32,20.08 60.24,20.13 60.19,20.21 60.17,20.31
GNDP on Top Layer: 60.04,1.93 60.06,2.03 60.11,2.11 60.2,2.17 60.29,2.19 64.56,2.19 64.66,2.17 64.74,2.11 64.79,2.03 64.81,1.93 64.81,1.13 64.79,1.04 64.74,0.95 64.66,0.9 64.56,0.88 60.29,0.88 60.2,0.9 60.11,0.95 60.06,1.04 60.04,1.13
GNDP on Top Layer: 64.94,11.76 60.28,11.76 60.2,11.68 60.2,10.67 60.32,10.54 60.45,10.54 60.58,10.41 60.58,9.77 61.46,9.77 61.59,9.91 61.59,10.41 61.79,10.61 64.94,10.61
GNDP on Top Layer: 23.77,29.84 29.79,29.84 29.79,26.73 23.77,26.73
GNDP on GND02: 14.8,29.69 73.5,29.69 73.5,0.16 14.8,0.16
VBUS on Top Layer: 61.21,29.34 61.23,29.43 61.29,29.52 61.37,29.57 61.47,29.59 65.95,29.59 66.05,29.57 66.13,29.52 66.18,29.43 66.2,29.34 66.2,26.69 66.18,26.59 66.13,26.51 66.05,26.45 65.95,26.43 61.47,26.43 61.37,26.45 61.29,26.51 61.23,26.59 61.21,26.69
VBUS on Top Layer: 61.23,19.75 61.25,19.84 61.3,19.93 61.38,19.98 61.48,20 65.96,20 66.06,19.98 66.14,19.93 66.2,19.84 66.22,19.75 66.22,17.1 66.2,17 66.14,16.92 66.06,16.86 65.96,16.84 61.48,16.84 61.38,16.86 61.3,16.92 61.25,17 61.23,17.1
VBUS on Top Layer: 15.46,29.84 25.19,29.84 25.19,28.31 15.46,28.31
VBUS on Top Layer: 66.04,10.03 65.97,10.21 65.79,10.29 62.48,10.29 62.38,10.27 62.3,10.21 61.16,9.07 61.11,8.99 61.09,8.89 61.09,8.23 61.11,8.14 61.16,8.05 61.88,7.33 61.97,7.28 62.06,7.26 65.79,7.26 65.97,7.33 66.04,7.51
VBUS on PWR03: 0.16,29.69 73.5,29.69 73.5,0.16 0.16,0.16
VCC_3V3 on Top Layer: 31.24,19.34 32.61,19.34 32.77,19.18 34.73,19.18 34.73,19.46 34,20.19 31.24,20.19
VCC_3V3 on Top Layer: 20.07,12.16 20.14,12.34 20.32,12.42 21.08,12.42 21.26,12.34 21.34,12.16 21.34,7.37 21.26,7.19 21.08,7.11 19.04,7.11 18.86,7.19 18.79,7.37 18.79,10.87 18.81,10.97 18.86,11.05 19.01,11.2 19.09,11.26 19.19,11.27 19.77,11.27 19.87,11.29 19.95,11.35 19.99,11.39 20.05,11.47 20.07,11.57
VCC_3V3 on PWR03: 0.16,24.05 48.2,24.05 48.2,0.16 0.16,0.16
OUT1 on Top Layer: 62.1,6.69 61.92,6.62 61.85,6.44 61.85,2.94 61.92,2.76 62.1,2.68 64.27,2.68 64.36,2.66 64.45,2.61 66.32,0.74 66.4,0.68 66.5,0.67 71.4,0.67 71.58,0.74 71.65,0.92 71.65,6.44 71.58,6.62 71.4,6.69
OUT2 on Top Layer: 62.24,16.28 62.06,16.21 61.99,16.03 61.99,12.53 62.06,12.35 62.24,12.27 64.41,12.27 64.5,12.25 64.59,12.2 66.46,10.33 66.54,10.27 66.64,10.25 71.54,10.25 71.72,10.33 71.79,10.51 71.79,16.03 71.72,16.21 71.54,16.28
OUT3 on Top Layer: 62.23,25.87 62.05,25.8 61.98,25.62 61.98,22.11 62.05,21.93 62.23,21.86 64.39,21.86 64.49,21.84 64.57,21.79 66.44,19.92 66.53,19.86 66.62,19.84 71.52,19.84 71.7,19.92 71.78,20.1 71.78,25.62 71.7,25.8 71.52,25.87
$9N1462 on Top Layer: 56.77,8.89 56.79,8.99 56.84,9.07 56.93,9.12 57.02,9.14 60.2,9.14 60.3,9.12 60.38,9.07 60.43,8.99 60.45,8.89 60.45,6.84 60.43,6.75 60.38,6.66 60.3,6.61 60.2,6.59 57.02,6.59 56.93,6.61 56.84,6.66 56.79,6.75 56.77,6.84
$9N2053 on Top Layer: 56.91,18.48 56.93,18.57 56.98,18.66 57.07,18.71 57.16,18.73 60.34,18.73 60.44,18.71 60.52,18.66 60.57,18.57 60.59,18.48 60.59,16.43 60.57,16.33 60.52,16.25 60.44,16.2 60.34,16.18 57.16,16.18 57.07,16.2 56.98,16.25 56.93,16.33 56.91,16.43
$9N2529 on Top Layer: 56.9,28.07 56.92,28.16 56.97,28.25 57.05,28.3 57.15,28.32 60.32,28.32 60.42,28.3 60.5,28.25 60.56,28.16 60.58,28.07 60.58,26.02 60.56,25.92 60.5,25.84 60.42,25.79 60.32,25.77 57.15,25.77 57.05,25.79 56.97,25.84 56.92,25.92 56.9,26.02
VBUS on Top Layer: 16.76,11.94 17.4,11.94 17.58,12.01 17.65,12.19 17.65,12.6 17.63,12.69 17.58,12.77 17.09,13.26 17.04,13.34 17.02,13.44 17.02,18.46 17,18.55 16.94,18.64 16.87,18.71 16.79,18.76 16.69,18.78 12.06,18.78 11.96,18.8 11.88,18.86 11.12,19.61 11.04,19.67 10.94,19.69 0.25,19.69 0.07,19.61 0,19.43 0,13.01 0.07,12.83 0.25,12.75 16.22,12.75 16.32,12.73 16.4,12.68 16.69,12.39 16.74,12.31 16.76,12.21
$1N4062 on Top Layer: 17.7,10.67 17.7,7.41 17.63,7.23 17.45,7.15 16.78,7.15 16.6,7.23 16.53,7.41 16.53,9.31 16.55,9.41 16.6,9.49 17.14,10.02 17.19,10.11 17.21,10.2 17.21,10.67

Small or netless copper shapes (teardrops, artwork), in the pictures only: 69 on Top Layer, 28 on Bottom Layer

## Text on the board
Top Silkscreen Layer: GND | RX | TX | SWCLK | SWDIO | 3V3
